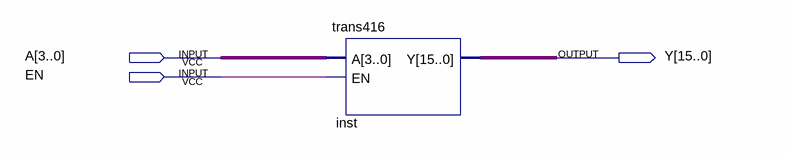
[diagram p0: schematic sheet]
// Quartus schematic project1.bdf as structural Verilog: 1 symbols, 3 pins
module project1 (
  input  [3:0] A,
  input  EN,
  output [15:0] Y
);

  trans416 inst (.A(A), .EN(EN), .Y(Y));
endmodule
